# EAGLE design 610_motor (EAGLE 9.6.2)
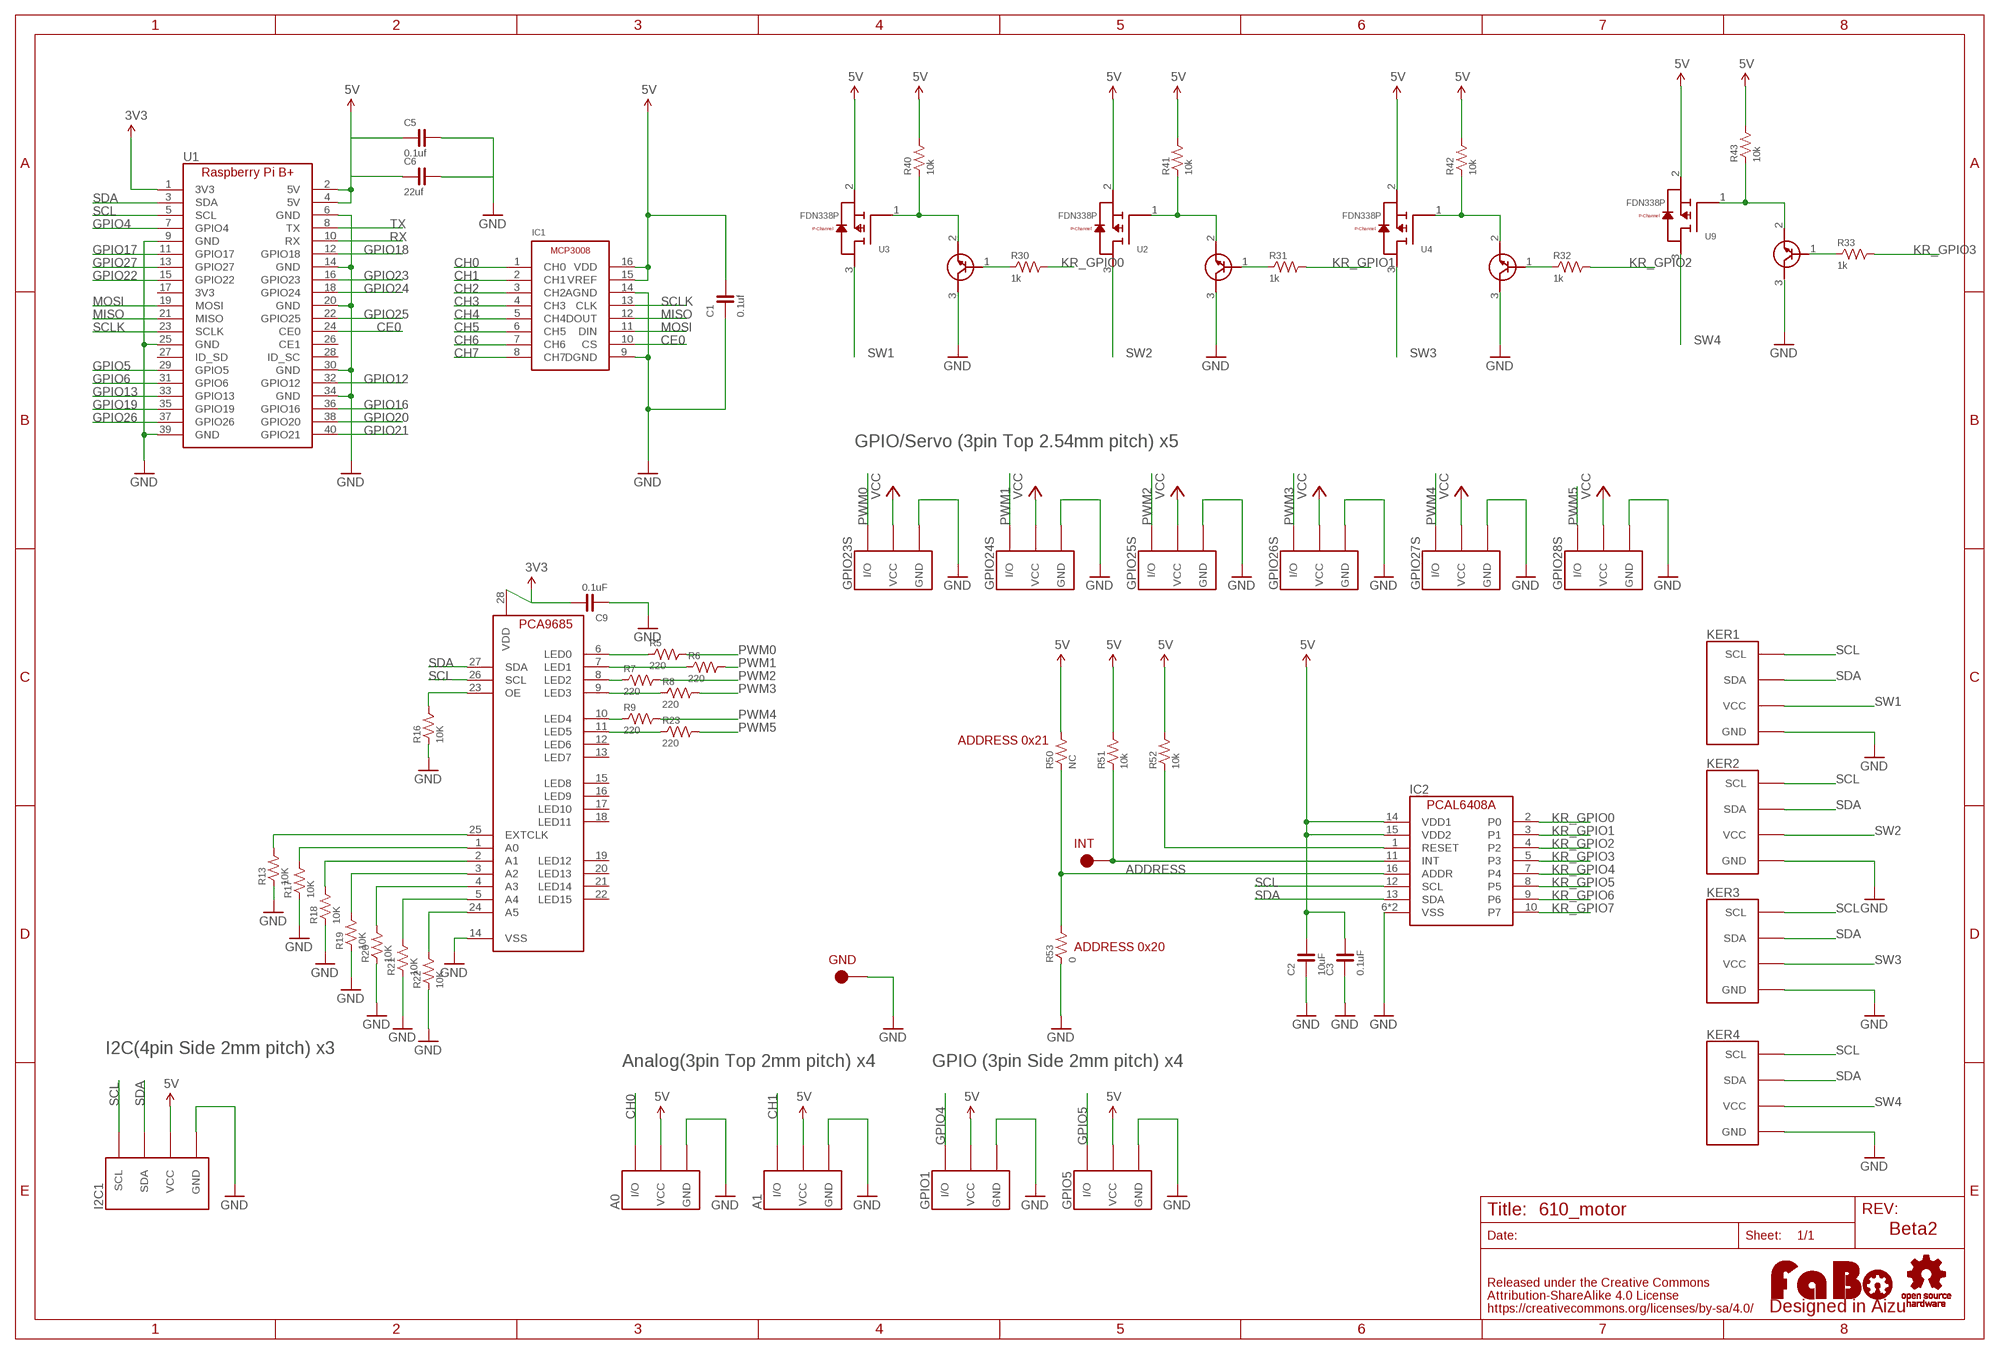
[diagram p0: schematic, sheet 1]

## Parts
A0  FABO_BRICK_3PIN-B03B-PASK-1  [FABO_BRICK_3PIN_B03B-PASK-1]
A1  FABO_BRICK_3PIN-B03B-PASK-1  [FABO_BRICK_3PIN_B03B-PASK-1]
C1  0.1uf  CAPACITOR-0603  [0603]
C2  10uF  CAPACITOR-0603  [0603]
C3  0.1uF  CAPACITOR-0603  [0603]
C5  0.1uf  CAPACITOR-0603  [0603]
C6  22uf  CAPACITOR-0603  [0603]
C9  0.1uF  CAPACITOR-0603  [0603]
GPIO1  FABO_BRICK_3PIN-B03B-PASK-1  [FABO_BRICK_3PIN_B03B-PASK-1]
GPIO5  FABO_BRICK_3PIN-B03B-PASK-1  [FABO_BRICK_3PIN_B03B-PASK-1]
GPIO23S  FABO_BRICK_3PIN-HEADER  [FABO_BRICK_3PIN_HEADER]
GPIO24S  FABO_BRICK_3PIN-HEADER  [FABO_BRICK_3PIN_HEADER]
GPIO25S  FABO_BRICK_3PIN-HEADER  [FABO_BRICK_3PIN_HEADER]
GPIO26S  FABO_BRICK_3PIN-HEADER  [FABO_BRICK_3PIN_HEADER]
GPIO27S  FABO_BRICK_3PIN-HEADER  [FABO_BRICK_3PIN_HEADER]
GPIO28S  FABO_BRICK_3PIN-HEADER  [FABO_BRICK_3PIN_HEADER]
I2C1  FABO_BRICK_I2C-S04B-PASK-2  [FABO_BRICK_I2C_S04B-PASK-2]
IC1  MICROCHIP-MCP3008  [MICROCHIP-MCP3008]
IC2  NX-PCAL6408A  [NXP-PCAL6408A]
KER1  FABO_BRICK_I2C-S04B-PASK-2  [FABO_BRICK_I2C_S04B-PASK-2]
KER2  FABO_BRICK_I2C-S04B-PASK-2  [FABO_BRICK_I2C_S04B-PASK-2]
KER3  FABO_BRICK_I2C-S04B-PASK-2  [FABO_BRICK_I2C_S04B-PASK-2]
KER4  FABO_BRICK_I2C-S04B-PASK-2  [FABO_BRICK_I2C_S04B-PASK-2]
LOGO1  LOGO_FABO-M  [LOGO_FABO_M]
R5  220  RESISTOR-0603  [0603]
R6  220  RESISTOR-0603  [0603]
R7  220  RESISTOR-0603  [0603]
R8  220  RESISTOR-0603  [0603]
R9  220  RESISTOR-0603  [0603]
R13  10K  RESISTOR-0402  [0402]
R16  10K  RESISTOR-0603  [0603]
R17  10K  RESISTOR-0603  [0603]
R18  10K  RESISTOR-0603  [0603]
R19  10K  RESISTOR-0603  [0603]
R20  10K  RESISTOR-0603  [0603]
R21  10K  RESISTOR-0603  [0603]
R22  10K  RESISTOR-0402  [0402]
R23  220  RESISTOR-0603  [0603]
R30  1k  RESISTOR-0603-NARROW  [0603-NARROW]
R31  1k  RESISTOR-0603-NARROW  [0603-NARROW]
R32  1k  RESISTOR-0603-NARROW  [0603-NARROW]
R33  1k  RESISTOR-0603-NARROW  [0603-NARROW]
R40  10k  RESISTOR-0603-NARROW  [0603-NARROW]
R41  10k  RESISTOR-0603-NARROW  [0603-NARROW]
R42  10k  RESISTOR-0603-NARROW  [0603-NARROW]
R43  10k  RESISTOR-0603-NARROW  [0603-NARROW]
R50  NC  RESISTOR-0603-NARROW  [0603-NARROW]
R51  10k  RESISTOR-0603-NARROW  [0603-NARROW]
R52  10k  RESISTOR-0603-NARROW  [0603-NARROW]
R53  0  RESISTOR-0603-NARROW  [0603-NARROW]
T1  TRANSISTORMMBT2222  [SOT-23]
T2  TRANSISTORMMBT2222  [SOT-23]
T3  TRANSISTORMMBT2222  [SOT-23]
T4  TRANSISTORMMBT2222  [SOT-23]
TP1  TP-15  [TP-15]
TP2  TP-15  [TP-15]
U1  RASPBERRY_PI_B+  [RASPBERRY_PI_B+]
U2  FDN338P  [SOT-23]
U3  FDN338P  [SOT-23]
U4  FDN338P  [SOT-23]
U9  FDN338P  [SOT-23]
U$2  LOGO_OSHW-M_BOTTOM  [LOGO_OSHW_M_BOTTOM]
U$9  PCA9685  [PCA9685]

## Nets
3V3: C9.2 U1.1(3V3) U$9.28(VDD)
5V: A0.VCC A1.VCC C1.2 C2.2 C3.2 C5.1 C6.1 GPIO1.VCC GPIO5.VCC I2C1.VCC IC1.15(VREF) IC1.16(VDD) IC2.14(VDD1) IC2.15(VDD2) R40.2 R41.2 R42.2 R43.2 R50.2 R51.2 R52.2 U1.2(5V) U1.4(5V) U2.2(S) U3.2(S) U4.2(S) U9.2(S)
ADDRESS: IC2.16(ADDR) R50.1 R53.2
CE0: IC1.10(CS) U1.24(CE0)
CH0: A0.I/O IC1.1(CH0)
CH1: A1.I/O IC1.2(CH1)
CH2: IC1.3(CH2)
CH3: IC1.4(CH3)
CH4: IC1.5(CH4)
CH5: IC1.6(CH5)
CH6: IC1.7(CH6)
CH7: IC1.8(CH7)
GND: A0.GND A1.GND C1.1 C2.1 C3.1 C5.2 C6.2 C9.1 GPIO1.GND GPIO5.GND GPIO23S.GND GPIO24S.GND GPIO25S.GND GPIO26S.GND GPIO27S.GND GPIO28S.GND I2C1.GND IC1.9(DGND) IC1.14(AGND) IC2.6(VSS) IC2.17(VSS) KER1.GND KER2.GND KER3.GND KER4.GND R13.P$1 R16.1 R17.1 R18.1 R19.1 R20.1 R21.1 R22.P$1 R53.1 T1.3(C) T2.3(C) T3.3(C) T4.3(C) TP2.1 U1.6(GND) U1.9(GND) U1.14(GND) U1.20(GND) U1.25(GND) U1.30(GND) U1.34(GND) U1.39(GND) U$9.14(VSS)
GPIO4: GPIO1.I/O U1.7(GPIO4)
GPIO5: GPIO5.I/O U1.29(GPIO5)
GPIO6: U1.31(GPIO6)
GPIO12: U1.32(GPIO12)
GPIO13: U1.33(GPIO13)
GPIO16: U1.36(GPIO16)
GPIO17: U1.11(GPIO17)
GPIO18: U1.12(GPIO18)
GPIO19: U1.35(GPIO19)
GPIO20: U1.38(GPIO20)
GPIO21: U1.40(GPIO21)
GPIO22: U1.15(GPIO22)
GPIO23: U1.16(GPIO23)
GPIO24: U1.18(GPIO24)
GPIO25: U1.22(GPIO25)
GPIO26: U1.37(GPIO26)
GPIO27: U1.13(GPIO27)
KR_GPIO0: IC2.2(P0) R30.2
KR_GPIO1: IC2.3(P1) R31.2
KR_GPIO2: IC2.4(P2) R32.2
KR_GPIO3: IC2.5(P3) R33.2
KR_GPIO4: IC2.7(P4)
KR_GPIO5: IC2.8(P5)
KR_GPIO6: IC2.9(P6)
KR_GPIO7: IC2.10(P7)
LED0: R5.1 U$9.6(LED0)
LED1: R6.1 U$9.7(LED1)
LED2: R7.1 U$9.8(LED2)
LED3: R8.1 U$9.9(LED3)
LED4: R9.1 U$9.10(LED4)
LED5: R23.1 U$9.11(LED5)
MISO: IC1.12(DOUT) U1.21(MISO)
MOSI: IC1.11(DIN) U1.19(MOSI)
N$2: R31.1 T2.1(B)
N$3: IC2.11(INT) R51.1 TP1.1
N$4: R40.1 T1.2(E) U3.1(G)
N$5: R41.1 T2.2(E) U2.1(G)
N$6: R30.1 T1.1(B)
N$7: R16.2 U$9.23(OE)
N$8: R13.P$2 U$9.25(EXTCLK)
N$9: R17.2 U$9.1(A0)
N$10: R18.2 U$9.2(A1)
N$11: R19.2 U$9.3(A2)
N$12: R20.2 U$9.4(A3)
N$13: R21.2 U$9.5(A4)
N$14: R22.P$2 U$9.24(A5)
N$15: R42.1 T3.2(E) U4.1(G)
N$16: R32.1 T3.1(B)
N$17: IC2.1(RESET) R52.1
N$18: R43.1 T4.2(E) U9.1(G)
N$19: R33.1 T4.1(B)
PWM0: GPIO23S.I/O R5.2
PWM1: GPIO24S.I/O R6.2
PWM2: GPIO25S.I/O R7.2
PWM3: GPIO26S.I/O R8.2
PWM4: GPIO27S.I/O R9.2
PWM5: GPIO28S.I/O R23.2
RX: U1.10(RX)
SCL: I2C1.SCL IC2.12(SCL) KER1.SCL KER2.SCL KER3.SCL KER4.SCL U1.5(SCL) U$9.26(SCL)
SCLK: IC1.13(CLK) U1.23(SCLK)
SDA: I2C1.SDA IC2.13(SDA) KER1.SDA KER2.SDA KER3.SDA KER4.SDA U1.3(SDA) U$9.27(SDA)
SW1: KER1.VCC U3.3(D)
SW2: KER2.VCC U2.3(D)
SW3: KER3.VCC U4.3(D)
SW4: KER4.VCC U9.3(D)
TX: U1.8(TX)
VCC: GPIO23S.VCC GPIO24S.VCC GPIO25S.VCC GPIO26S.VCC GPIO27S.VCC GPIO28S.VCC
Unconnected: U1.17(3V3) U1.26(CE1) U1.27(ID_SD) U1.28(ID_SC) U$9.12(LED6) U$9.13(LED7) U$9.15(LED8) U$9.16(LED9) U$9.17(LED10) U$9.18(LED11) U$9.19(LED12) U$9.20(LED13) U$9.21(LED14) U$9.22(LED15)

## Notes on the sheet
- GPIO/Servo (3pin Top 2.54mm pitch) x5
- ADDRESS 0x21
- INT
- ADDRESS 0x20
- GND
- I2C(4pin Side 2mm pitch) x3
- Analog(3pin Top 2mm pitch) x4 | GPIO (3pin Side 2mm pitch) x4
- Beta2

## Library data of the parts
A0 A1 GPIO1 GPIO5 GPIO23S GPIO24S GPIO25S GPIO26S GPIO27S GPIO28S = FaBo-Template:FABO_BRICK_3PIN: FaBo Brick 3pin
C1-C3 C5 C6 C9 = FaBo-Capacitor:CAPACITOR: CAPACITOR
I2C1 KER1-KER4 = FaBo-Template:FABO_BRICK_I2C: FaBo Brick I2C
IC1 = FaBo-ADC:MICROCHIP-MCP3008
IC2 = FaBo-Mems:NX-PCAL6408A: NXP PCAL6408A
LOGO1 = component:LOGO_FABO
R5-R9 R13 R16-R23 R30-R33 R40-R43 R50-R53 = FaBo-Resistors:RESISTOR: RESISTOR
T1-T4 = FaBo-Transistor:TRANSISTOR
TP1 TP2 = FaBo-Supply:TP
U1 = FaBo-Boards:RASPBERRY_PI_B+
U2-U4 U9 = FaBo-Mosfet2:FDN338P
U$2 = component:LOGO_OSHW
U$9 = FaBo-Motor:PCA9685

## Board
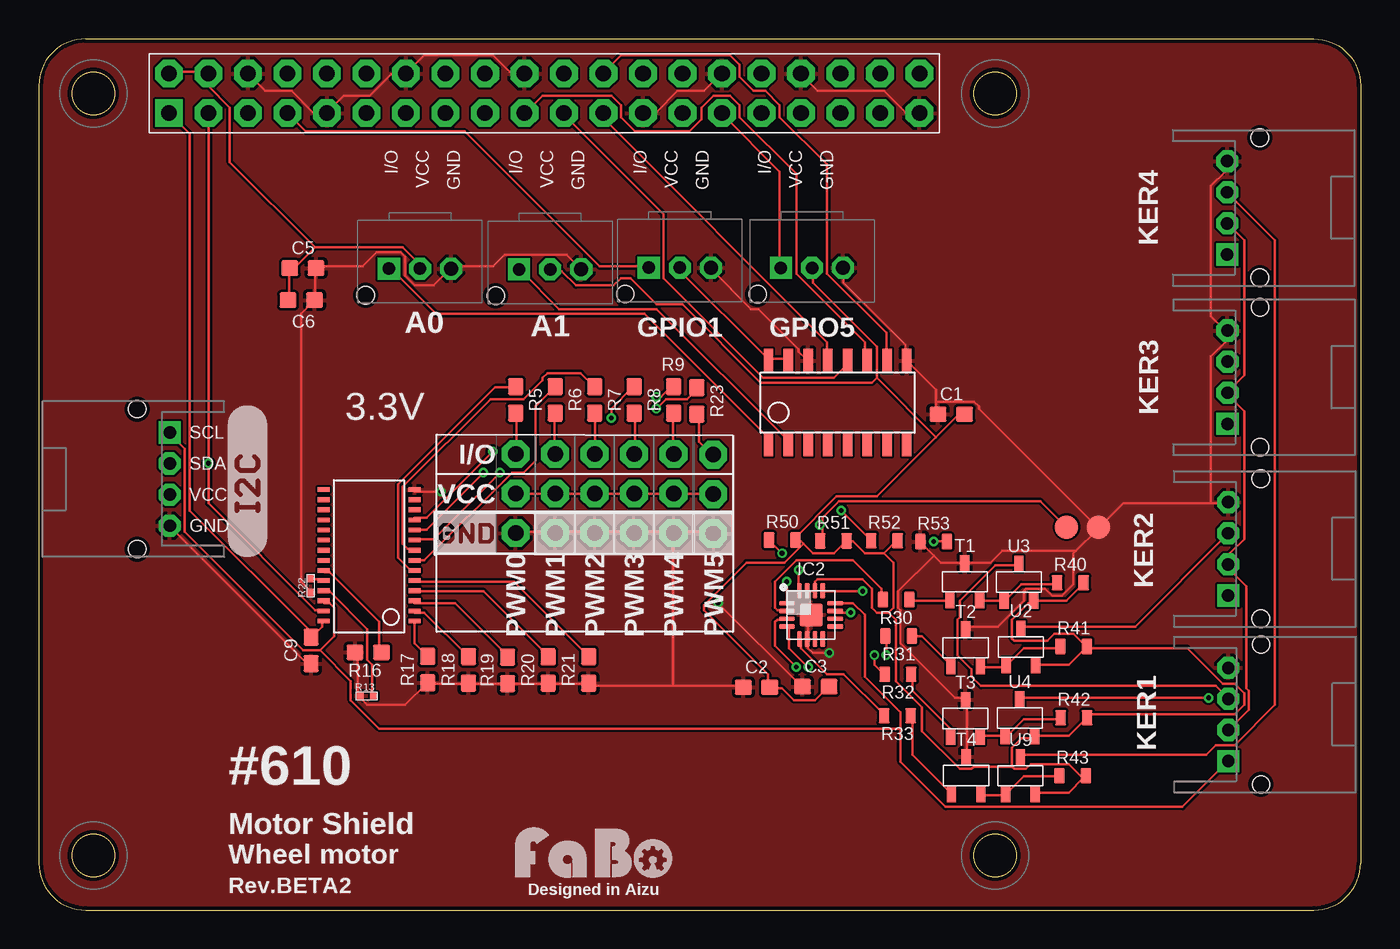
[diagram p1: board, top side]
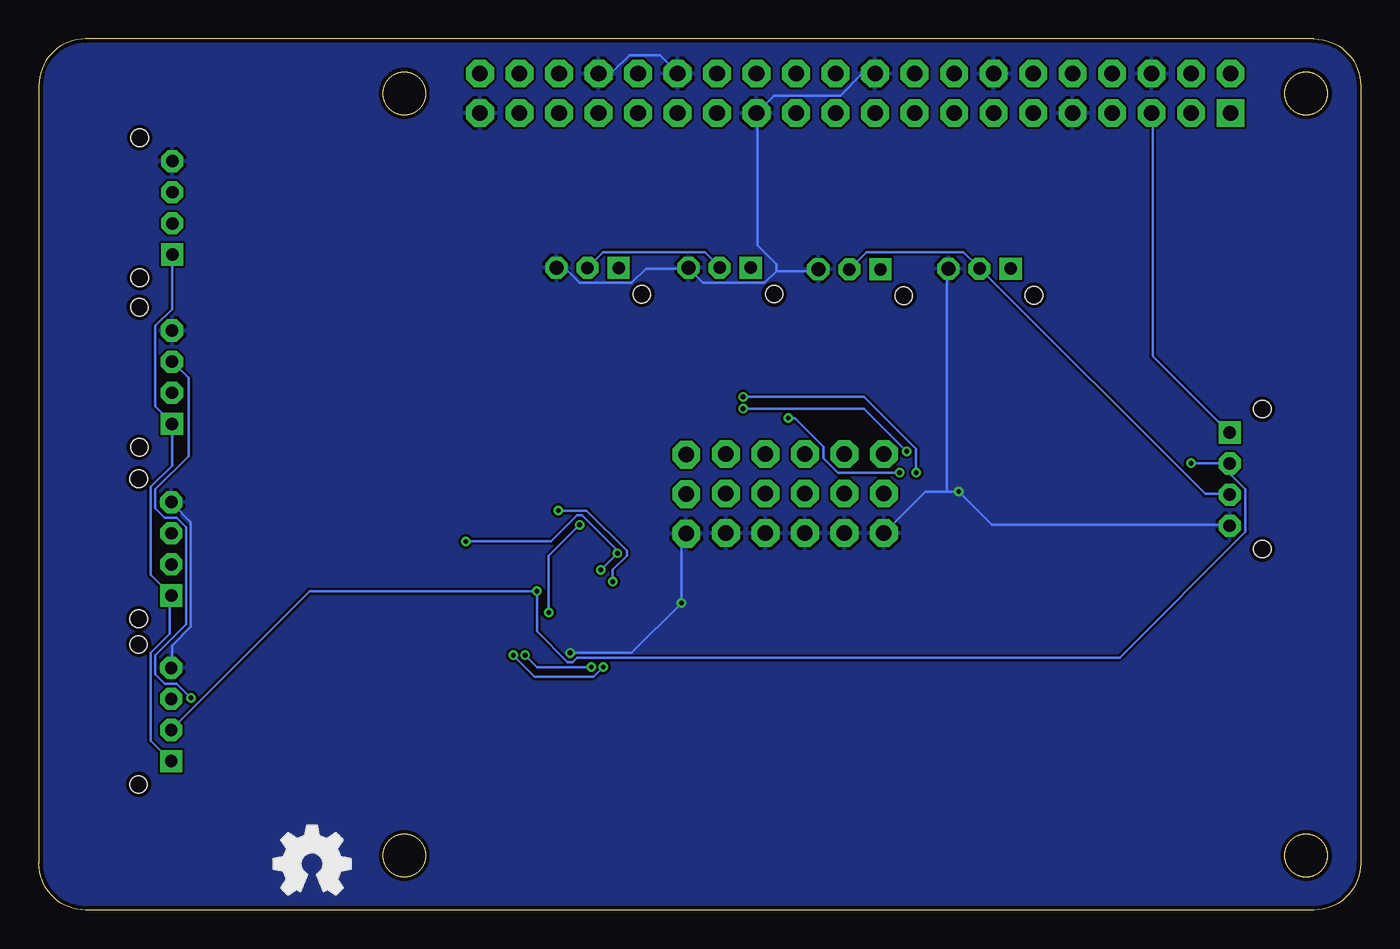
[diagram p2: board, bottom side, seen from below]

Size 85 x 56 mm. Coordinates in mm from the lower left corner, seen from the top.
Copper layers (1*16): Top 0.035mm / dielectric 1.6mm / Bottom 0.035mm
Design rules "PCBway": minimum track width 6mil, minimum drill 12mil, track to track 6mil, track to pad 6mil, pad to pad 6mil, via to via 6mil, smd to smd 6mil, copper to edge 10mil, drill to drill 10mil, minimum pad ring 10mil, minimum via ring 6mil, stop-mask expansion 2mil, vias tented up to drill 100mil, thermal gap 8mil

### Footprints (pad centres in the part's own frame; a part is rotated, then mirrored left to right if it is on the bottom)
FABO_BRICK_3PIN_B03B-PASK-1 = drill 0.9 pad 1.422 octagon: GND -2,0 | drill 0.8 pad 1.422 square: I/O 2,0 | drill 0.8 pad 1.422 octagon: VCC 0,0 | hole 1.1: 3.5,1.7
0603 = smd 1.1 x 1: 1 -0.85,0; 2 0.85,0
FABO_BRICK_3PIN_HEADER = drill 1 pad 1.778 octagon: GND -2.54,0; I/O 2.54,0; VCC 0,0
FABO_BRICK_I2C_S04B-PASK-2 = drill 0.8 pad 1.422 octagon: GND -3,0; SDA 1,0; VCC -1,0 | drill 0.8 pad 1.422 square: SCL 3,0 | hole 1.1: 4.5,2.1; -4.5,2.1
MICROCHIP-MCP3008 = smd 0.6 x 1.5: 1 -4.445,-2.7; 2 -3.175,-2.7; 3 -1.905,-2.7; 4 -0.635,-2.7; 5 0.635,-2.7; 6 1.905,-2.7; 7 3.175,-2.7; 8 4.445,-2.7; 9 4.445,2.7; 10 3.175,2.7; 11 1.905,2.7; 12 0.635,2.7; 13 -0.635,2.7; 14 -1.905,2.7; 15 -3.175,2.7; 16 -4.445,2.7
NXP-PCAL6408A = smd 1 x 0.3: 1 -1.55,0.75; 2 -1.55,0.25; 3 -1.55,-0.25; 4 -1.55,-0.75; 9 1.55,-0.75; 10 1.55,-0.25; 11 1.55,0.25; 12 1.55,0.75 | smd 0.3 x 1: 5 -0.75,-1.55; 6 -0.25,-1.55; 7 0.25,-1.55; 8 0.75,-1.55; 13 0.75,1.55; 14 0.25,1.55; 15 -0.25,1.55; 16 -0.75,1.55 | smd 1.5 x 1.5: 17 0,0
0402 = smd 0.5 x 0.5: P$1 -0.46,0; P$2 0.46,0
0603-NARROW = smd 0.71 x 1: 1 -0.85,0; 2 0.85,0
SOT-23 = smd 0.6 x 1: 1 -0.95,-1.2; 2 0.95,-1.2; 3 0,1.2
TP-15 = smd 1.5 x 1.5: 1 0,0
RASPBERRY_PI_B+ = drill 1 pad 1.778 square: 1 0,-2.54 | drill 1 pad 1.778 octagon: 2 0,0; 3 2.54,-2.54; 4 2.54,0; 5 5.08,-2.54; 6 5.08,0; 7 7.62,-2.54; 8 7.62,0; 9 10.16,-2.54; 10 10.16,0; 11 12.7,-2.54; 12 12.7,0; 13 15.24,-2.54; 14 15.24,0; 15 17.78,-2.54; 16 17.78,0; 17 20.32,-2.54; 18 20.32,0; 19 22.86,-2.54; 20 22.86,0; 21 25.4,-2.54; 22 25.4,0; 23 27.94,-2.54; 24 27.94,0; 25 30.48,-2.54; 26 30.48,0; 27 33.02,-2.54; 28 33.02,0; 29 35.56,-2.54; 30 35.56,0; 31 38.1,-2.54; 32 38.1,0; 33 40.64,-2.54; 34 40.64,0; 35 43.18,-2.54; 36 43.18,0; 37 45.72,-2.54; 38 45.72,0; 39 48.26,-2.54; 40 48.26,0
PCA9685 = smd 0.3 x 0.75: 1 -4.15,-2.93; 2 -3.5,-2.93; 3 -2.85,-2.93; 4 -2.2,-2.93; 5 -1.55,-2.93; 6 -0.9,-2.93; 7 -0.25,-2.93; 8 0.4,-2.93; 9 1.05,-2.93; 10 1.7,-2.93; 11 2.35,-2.93; 12 3,-2.93; 13 3.65,-2.93; 14 4.3,-2.93; 15 4.3,2.92; 16 3.65,2.92; 17 3,2.92; 18 2.35,2.92; 19 1.7,2.92; 20 1.05,2.92; 21 0.4,2.92; 22 -0.25,2.92; 23 -0.9,2.92; 24 -1.55,2.92; 25 -2.2,2.92; 26 -2.85,2.92; 27 -3.5,2.92; 28 -4.15,2.92

### Placement (x,y rotation side)
A0  24.51,41.23 180 top
A1  32.88,41.19 180 top
C1  58.68,31.87 0 top
C2  46.15,14.32 0 top
C3  49.96,14.36 0 top
C5  16.98,41.26 0 top
C6  16.88,39.21 0 top
C9  17.51,16.69 90 top
GPIO1  41.22,41.29 180 top
GPIO5  49.72,41.28 180 top
GPIO23S  30.66,26.77 90 top
GPIO24S  33.2,26.77 90 top
GPIO25S  35.74,26.77 90 top
GPIO26S  38.28,26.77 90 top
GPIO27S  40.82,26.77 90 top
GPIO28S  43.37,26.73 90 top
I2C1  8.42,27.7 90 top
IC1  51.37,32.62 0 top
IC2  49.66,18.97 0 top
KER1  76.49,12.57 270 top
KER2  76.48,23.22 270 top
KER3  76.44,34.25 270 top
KER4  76.42,45.14 270 top
LOGO1  35.67,1.7 0 top
R5  30.66,32.8 270 top
R6  33.2,32.8 270 top
R7  35.74,32.8 270 top
R8  38.28,32.8 270 top
R9  40.82,32.8 270 top
R13  21.08,13.76 0 top
R16  21.18,16.56 0 top
R17  25.01,15.45 90 top
R18  27.63,15.44 90 top
R19  30.14,15.41 90 top
R20  32.75,15.43 90 top
R21  35.35,15.44 90 top
R22  17.48,20.85 90 top
R23  42.32,32.73 270 top
R30  55.13,19.95 180 top
R31  55.29,17.61 180 top
R32  55.25,15.16 180 top
R33  55.21,12.49 180 top
R40  66.33,21.04 0 top
R41  66.54,16.95 0 top
R42  66.56,12.36 0 top
R43  66.48,8.63 0 top
R50  47.81,23.78 0 top
R51  51.1,23.73 0 top
R52  54.37,23.74 0 top
R53  57.54,23.68 0 top
T1  59.54,21.1 0 top
T2  59.6,16.86 0 top
T3  59.59,12.31 0 top
T4  59.63,8.64 0 top
TP1  66.09,24.61 0 top
TP2  68.13,24.61 0 top
U1  8.37,53.77 0 top
U2  63.15,16.91 0 top
U3  63.02,21.08 0 top
U4  63.08,12.35 0 top
U9  63.12,8.63 0 top
U$2  67.42,2.97 0 top
U$6  [LOGO_SILK_I2C]  14.67,22.7 90 top
U$7  [LOGO_SILK_GND]  25.58,22.96 0 top
U$9  21.23,22.73 90 top

### Tracks (layer width: path | path; a pad name or v marks a point on that pad's centre or on a via)
3V3
  Top 0.152: U$9.28 18.23,18.52 18.23,18.21 17.62,17.6 C9.2 17.46,17.6 17.46,17.91 9.69,25.68 9.69,49.91 U1.1
5V
  Top 0.152: U1.2 8.47,53.87 10.91,53.87 U1.4 10.91,52.96 12.28,51.59 12.28,48.08 17.77,42.59 | C6.1 16.09,39.24 16.09,41.22 C5.1 16.24,41.38 16.55,41.38 17.77,42.59 | 17.77,42.59 23.41,42.59 24.63,41.38 A0.VCC | IC1.15 48.1,35.43 47.03,35.43 IC1.16 46.88,35.43 41.08,41.22 GPIO1.VCC | R40.2 67.15,20.95 66.08,19.89 64.1,19.89 U3.2 63.95,19.73 63.64,19.73 62.57,18.67 62.57,17.45 62.73,17.3 64.86,17.3 65.32,17.75 66.54,17.75 67.3,16.99 R41.2 | U2.2 64.25,15.77 66.23,15.77 67.3,16.84 R41.2 | 67.15,8.46 67.3,8.61 R43.2 67.15,8.46 | 67.15,8.46 66.23,7.54 64.1,7.54 U9.2 | 67.15,8.46 66.23,9.37 63.79,9.37 63.49,9.07 62.73,9.07 62.57,9.22 | 62.57,9.22 62.57,10.44 63.18,11.05 63.95,11.05 U4.2 64.1,11.2 66.23,11.2 67.3,12.27 R42.2 67.45,12.42 67.6,12.57 76.9,12.57 77.51,13.18 77.51,13.94 76.9,14.55 76.14,14.55 73.85,16.84 67.45,16.84 R41.2 | C3.2 50.69,14.25 49.92,13.49 48.55,13.49 47.79,14.25 47.03,14.25 C2.2 46.88,14.4 46.88,15.16 42.76,19.28 42.76,19.58 45.5,22.33 47.94,22.33 49.16,23.54 | IC2.15 49.47,20.5 49.77,20.5 IC2.14 49.92,20.65 49.92,21.11 50.08,21.26 52.97,21.26 53.58,20.65 53.58,19.43 53.89,19.12 54.65,19.12 | 54.34,22.93 53.12,22.93 52.36,23.7 52.06,23.7 R51.2 51.91,23.7 51.14,22.93 49.77,22.93 49.16,23.54 | 54.34,22.93 55.11,23.7 R52.2 | 49.16,23.54 49.01,23.7 48.7,23.7 R50.2 48.55,23.85 51.3,26.59 53.89,26.59 57.7,30.4 | 57.7,30.4 59.07,31.77 59.53,31.77 C1.2 | 54.65,19.12 54.95,19.43 54.95,22.33 54.34,22.93 | 62.57,9.22 60.13,9.22 59.98,9.07 59.22,9.07 56.78,11.5 56.78,13.03 55.11,14.71 55.11,18.67 54.65,19.12 | 53.89,34.21 53.89,36.19 49.77,40.31 49.77,41.22 GPIO5.VCC
  Top 0.152: 57.7,30.4 53.89,34.21 | 53.89,34.21 53.58,33.91 46.42,33.91 41.39,38.94 39.71,38.94 38.04,40.61 37.43,40.61 36.97,40.16 34.53,40.16 33.62,41.07 33.01,41.07 A1.VCC
  Bottom 0.152: I2C1.VCC 8.47,26.74 10,26.74 24.47,41.22 A0.VCC 24.63,41.38 25.54,42.29 31.79,42.29 32.86,41.22 A1.VCC | GPIO5.VCC 49.62,41.38 48.7,42.29 42.15,42.29 41.24,41.38 GPIO1.VCC
ADDRESS  (via drill 0.3)
  Top 0.152: v48.86,21.87 48.86,20.65 IC2.16 | v47.79,22.93 47.03,23.7 R50.1 | v57.54,23.7 58.31,23.7 R53.2
  Bottom 0.152: v48.86,21.87 v47.79,22.93 47.79,23.09 50.08,25.37 50.38,25.37 52.06,23.7 v57.54,23.7
CE0
  Top 0.152: IC1.10 54.5,35.43 54.5,37.11 50.69,40.92 50.69,47.93 47.64,50.98 47.64,51.74 46.72,52.65 45.96,52.65 45.05,53.57 45.05,54.33 44.44,54.94 37.43,54.94 36.36,53.87 U1.24
CH0
  Top 0.152: IC1.1 46.88,29.95 46.88,30.4 38.95,38.33 25.54,38.33 22.64,41.22 A0.I/O
CH1
  Top 0.152: IC1.2 48.1,29.95 48.1,30.25 39.71,38.63 33.46,38.63 31.03,41.07 A1.I/O
GND  (via drill 0.3)
  Top 0.152: T4.3 59.68,9.98 59.68,13.49 T3.3 59.53,13.64 58.92,13.64 55.41,17.14 55.41,19.28 55.26,19.43 55.26,20.5 57.54,22.78 | 57.54,22.78 58,22.33 59.53,22.33 T1.3 59.68,22.33 61.2,22.33 61.96,23.09 66.69,23.09 | 57.54,22.78 56.78,23.54 R53.1 | KER4.GND 76.29,48.08 76.29,47.47 75.38,46.56 75.38,38.17 76.29,37.26 KER3.GND 76.29,37.11 76.29,36.5 75.38,35.58 75.38,26.14 | 66.69,23.09 68.06,24.46 TP2.1 | 66.69,23.09 66.54,22.93 66.54,20.95 65.77,20.19 65.16,20.19 64.71,20.65 63.49,20.65 63.34,20.5 63.34,19.89 61.66,18.21 59.68,18.21 T2.3 | 75.38,26.14 69.74,26.14 68.21,24.61 TP2.1 | 75.38,26.14 76.44,26.14 KER2.GND | R16.1 20.36,16.53 20.51,16.38 20.51,13.79 R13.P$1 20.66,13.64 21.12,13.18 23.56,13.18 24.93,14.55 R17.1 25.08,14.55 27.52,14.55 R18.1 27.67,14.55 30.11,14.55 R19.1 30.27,14.55 32.7,14.55 R20.1 32.86,14.55 35.29,14.55 R21.1 35.45,14.55 35.6,14.4 40.78,14.4 | 40.78,14.4 45.2,14.4 C2.1 | C9.1 17.46,15.92 17.16,15.92 8.47,24.61 I2C1.GND | v25.84,26.9 24.17,26.9 U$9.14 | GPIO23S.GND 30.72,24.31 33.16,24.31 GPIO24S.GND 33.31,24.31 35.6,24.31 GPIO25S.GND 35.75,24.31 38.19,24.31 GPIO26S.GND 38.34,24.31 40.78,24.31 GPIO27S.GND | IC2.17 49.62,18.82 49.47,18.67 49.47,17.45 IC2.6 49.47,17.3 49.47,16.84 49.77,16.53 v50.84,16.53 | v43.68,19.73 49.01,14.4 C3.1 | GPIO27S.GND 40.93,24.31 43.22,24.31 GPIO28S.GND | 40.78,14.4 40.78,24.15 GPIO27S.GND | 18.53,51.28 17.62,51.28 16.24,52.65 14.57,52.65 U1.6 | 18.53,51.28 19.6,52.35 21.27,52.35 22.64,53.72 23.56,53.72 U1.14 24.78,54.94 29.2,54.94 30.27,53.87 31.18,53.87 U1.20 | 18.53,51.28 U1.9 | U1.25 38.95,51.28 39.71,51.28 41.08,52.65 42.76,52.65 43.83,53.72 U1.30
  Top 0.152: U1.39 56.63,51.28 55.72,51.28 54.34,52.65 50.08,52.65 49.01,53.72 U1.34 | R22.P$1 17.46,20.5 16.85,21.11 16.85,38.33 17.62,39.09 C6.2 17.77,39.24 17.77,41.22 C5.2 17.92,41.38 20.82,41.38 21.73,42.29 23.25,42.29 23.56,41.98 23.56,40.77 24.17,40.16 25.39,40.16 26.45,41.22 A0.GND 26.61,41.38 29.2,41.38 29.96,42.14 33.92,42.14 34.84,41.22 A1.GND | 57.7,32.69 57.7,33.45 55.87,35.28 IC1.9 55.72,35.43 55.72,36.35 51.75,40.31 51.75,41.22 GPIO5.GND | 57.7,32.69 57.7,31.93 C1.1 | IC1.14 49.31,35.43 48.86,35.89 48.86,36.04 46.27,38.63 45.81,38.63 43.22,41.22 GPIO1.GND | 57.7,32.69 60.13,32.69 60.44,32.38 60.44,32.23 68.06,24.61 TP2.1
  Bottom 0.152: KER1.GND 76.44,15.62 76.44,16.99 75.22,18.21 75.22,24.92 76.44,26.14 KER2.GND | 26.61,26.9 27.98,26.9 30.57,24.31 GPIO23S.GND | 26.61,26.9 v25.84,26.9 23.71,24.76 8.47,24.76 I2C1.GND | GPIO28S.GND 43.37,24.15 43.68,23.85 v43.68,19.73 46.88,16.53 v50.84,16.53 | U1.34 49.01,53.87 48.1,53.87 47.03,54.94 45.05,54.94 43.98,53.87 U1.30 | U1.20 31.33,53.72 32.09,53.72 33.46,52.35 37.73,52.35 U1.25 38.8,51.13 38.8,42.75 37.58,41.53 37.58,41.07 | 37.58,41.07 34.99,41.07 A1.GND | 37.58,41.07 38.34,40.31 42.3,40.31 43.22,41.22 GPIO1.GND 43.37,41.22 45.96,41.22 46.88,40.31 50.23,40.31 51.14,41.22 51.6,41.22 GPIO5.GND | 26.61,26.9 26.61,41.22 A0.GND
  pour Top: -0.52,-0.84 85.84,-0.84 85.84,56.31 -0.52,56.31
  pour Bottom: -0.52,-0.84 85.84,-0.84 85.84,56.31 -0.52,56.31
GPIO4
  Top 0.152: U1.7 17.16,50.06 27.37,50.06 36.06,41.38 39.1,41.38 GPIO1.I/O
GPIO5
  Top 0.152: GPIO5.I/O 47.64,41.38 47.64,47.47 43.98,51.13 U1.29
KR_GPIO0
  Top 0.152: IC2.2 48.1,19.28 47.49,19.28 47.33,19.43 47.33,21.11 48.7,22.48 52.36,22.48 54.19,20.65 54.19,20.04 R30.2
KR_GPIO1  (via drill 0.3)
  Top 0.152: v48.7,15.62 47.33,16.99 47.33,18.52 47.49,18.67 48.1,18.67 IC2.3 | v54.5,16.38 54.5,17.6 R31.2
  Bottom 0.152: v48.7,15.62 49.31,15.01 53.12,15.01 v54.5,16.38
KR_GPIO2  (via drill 0.3)
  Top 0.152: v49.47,15.62 48.25,16.84 48.25,18.21 IC2.4 | v53.73,16.38 53.73,15.77 54.34,15.16 R32.2
  Bottom 0.152: v49.47,15.62 52.97,15.62 v53.73,16.38
KR_GPIO3
  Top 0.152: IC2.5 49.01,17.3 49.01,16.84 50.69,15.16 51.75,15.16 54.34,12.57 R33.2
LED0
  Top 0.152: U$9.6 24.02,21.87 23.86,21.87 23.1,22.63 23.1,27.35 29.35,33.6 30.57,33.6 R5.1
LED1
  Top 0.152: U$9.7 24.78,22.48 30.42,28.12 31.18,28.12 31.94,28.88 31.94,32.38 33.16,33.6 R6.1
LED2
  Top 0.152: U$9.8 24.02,23.24 23.71,23.24 23.41,23.54 23.41,27.2 29.05,32.84 31.18,32.84 32.4,34.06 32.4,34.21 32.7,34.52 34.84,34.52 35.6,33.76 R7.1
LED3  (via drill 0.3)
  Top 0.152: v29.66,28.12 25.39,23.85 24.17,23.85 U$9.9 | v36.82,31.62 36.82,32.23 38.19,33.6 R8.1
  Bottom 0.152: v29.66,28.12 33.62,28.12 34.53,29.03 34.53,29.79 36.36,31.62 v36.82,31.62
LED4  (via drill 0.3)
  Top 0.152: v28.59,28.12 24.93,24.46 24.17,24.46 U$9.10 | v39.71,32.99 40.02,32.99 40.78,33.76 R9.1
  Bottom 0.152: v28.59,28.12 28.59,29.64 31.94,32.99 v39.71,32.99
LED5  (via drill 0.3)
  Top 0.152: v29.2,29.49 24.93,25.22 24.17,25.22 U$9.11 | v39.71,32.23 40.32,32.84 41.7,32.84 42.3,33.45 R23.1
  Bottom 0.152: v29.2,29.49 31.94,32.23 v39.71,32.23
MISO
  Top 0.152: IC1.12 51.91,35.28 51.91,34.97 51.14,34.21 46.57,34.21 40.17,40.61 40.17,44.73 33.77,51.13 U1.21
MOSI
  Top 0.152: IC1.11 53.12,35.43 53.12,36.5 48.7,40.92 48.7,47.32 45.05,50.98 45.05,51.74 44.44,52.35 43.37,52.35 42.61,51.59 42.61,50.82 41.85,50.06 38.34,50.06 37.43,50.98 37.43,51.74 36.82,52.35 32.4,52.35 31.33,51.28 U1.19
N$2
  Top 0.152: R31.1 56.17,17.6 56.78,17.6 58.61,15.77 T2.1
N$3  (via drill 0.3)
  Top 0.152: 50.38,24.76 50.38,25.22 51.45,26.29 64.4,26.29 TP1.1 | 50.38,24.76 50.38,23.85 R51.1 | v52.21,19.12 51.3,19.12 IC2.11 | 50.38,24.76 v50.23,24.76
  Bottom 0.152: v52.21,19.12 52.21,22.78 v50.23,24.76
N$4
  Top 0.152: T1.2 60.59,19.89 61.96,19.89 U3.1 62.12,19.89 63.18,20.95 65.47,20.95 R40.1
N$5
  Top 0.152: T2.2 60.59,15.62 62.12,15.62 U2.1 62.27,15.77 63.34,16.84 65.62,16.84 R41.1
N$6
  Top 0.152: T1.1 58.46,19.89 56.02,19.89 R30.1
N$7
  Top 0.152: U$9.23 18.38,21.72 18.68,21.72 21.88,18.52 21.88,16.69 R16.2
N$8
  Top 0.152: R13.P$2 21.43,13.79 21.43,15.77 21.12,16.08 21.12,18.06 18.68,20.5 18.38,20.5 U$9.25
N$9
  Top 0.152: U$9.1 24.17,18.52 24.17,17.14 24.93,16.38 R17.2
N$10
  Top 0.152: U$9.2 24.17,19.12 24.78,19.12 27.52,16.38 R18.2
N$11
  Top 0.152: U$9.3 24.17,19.73 26.76,19.73 30.11,16.38 R19.2
N$12
  Top 0.152: U$9.4 24.17,20.5 28.59,20.5 32.7,16.38 R20.2
N$13
  Top 0.152: U$9.5 24.17,21.11 30.57,21.11 35.29,16.38 R21.2
N$14
  Top 0.152: R22.P$2 17.62,21.26 18.23,21.26 U$9.24
N$15
  Top 0.152: T3.2 60.59,11.2 62.12,11.2 U4.1 62.27,11.2 63.34,12.27 65.62,12.27 R42.1
N$16
  Top 0.152: R32.1 56.17,15.01 56.17,14.1 58.61,11.66 58.61,11.2 T3.1
N$17  (via drill 0.3)
  Top 0.152: v48.1,21.11 48.1,19.73 IC2.1 | v51.6,25.68 53.43,23.85 R52.1
  Bottom 0.152: v48.1,21.11 48.1,21.87 47.18,22.78 47.18,23.09 49.77,25.68 v51.6,25.68
N$18
  Top 0.152: T4.2 60.59,7.39 62.12,7.39 U9.1 62.27,7.54 63.34,8.61 65.62,8.61 R43.1
N$19
  Top 0.152: R33.1 56.17,12.42 56.17,9.98 58.61,7.54 T4.1
PWM0
  Top 0.152: R5.2 30.72,31.93 30.72,29.34 GPIO23S.I/O
PWM1
  Top 0.152: R6.2 33.16,31.93 33.16,29.34 GPIO24S.I/O
PWM2
  Top 0.152: R7.2 35.75,31.93 35.75,29.34 GPIO25S.I/O
PWM3
  Top 0.152: R8.2 38.34,31.93 38.34,29.34 GPIO26S.I/O
PWM4
  Top 0.152: R9.2 40.78,31.93 40.78,29.34 GPIO27S.I/O
PWM5
  Top 0.152: R23.2 42.46,31.77 42.46,30.1 43.22,29.34 GPIO28S.I/O
SCL
  Top 0.152: 18.07,16.69 18.99,17.6 18.99,19.43 18.68,19.73 18.38,19.73 U$9.26 | 18.07,16.69 17.01,16.69 9.39,24.31 9.39,29.64 8.47,30.55 I2C1.SCL | 55.41,11.66 55.41,9.52 58.31,6.63 73.55,6.63 76.44,9.52 KER1.SCL | 55.41,11.66 55.41,12.72 53.12,15.01 53.12,18.97 52.36,19.73 51.3,19.73 IC2.12 | 18.07,16.69 20.05,14.71 20.05,13.49 21.88,11.66 55.41,11.66
  Bottom 0.152: U1.5 13.35,51.13 13.35,35.58 8.47,30.71 I2C1.SCL | KER4.SCL 76.44,42.14 76.44,38.63 77.51,37.57 77.51,32.38 76.44,31.32 KER3.SCL 76.44,31.16 76.44,28.57 77.81,27.2 77.81,21.56 76.59,20.34 KER2.SCL 76.59,20.19 76.59,17.75 77.81,16.53 77.81,10.9 76.59,9.68 KER1.SCL
SCLK
  Top 0.152: IC1.13 50.69,35.43 50.69,36.5 36.36,50.82 36.36,51.13 U1.23
SDA  (via drill 0.3)
  Top 0.152: U1.3 v10.91,28.73 10.91,26.14 17.77,19.28 18.23,19.28 U$9.27 | KER4.SDA 77.51,43.05 77.51,34.36 76.44,33.3 KER3.SDA 76.44,33.15 77.51,32.08 77.51,23.85 76.59,22.93 76.59,22.33 KER2.SDA 76.59,22.17 76.59,21.87 77.66,20.8 77.66,14.25 77.81,14.1 77.81,12.88 76.59,11.66 KER1.SDA | v52.97,20.5 50.53,20.5 IC2.13
  Bottom 0.152: v10.91,28.73 8.47,28.73 I2C1.SDA 8.32,28.57 8.32,27.96 7.4,27.05 7.4,24.31 15.48,16.23 50.38,16.23 50.69,15.92 50.99,15.92 52.97,17.91 v52.97,20.5 67.6,20.5 76.44,11.66 KER1.SDA
SW1
  Top 0.152: U3.3 62.88,22.17 61.51,22.17 59.22,19.89 59.22,18.82 59.07,18.67 59.07,16.38 59.98,15.47 59.98,15.01 60.59,14.4 75.68,14.4 76.44,13.64 KER1.VCC
SW2
  Top 0.152: U2.3 63.18,18.21 70.5,18.21 76.44,24.15 KER2.VCC
SW3  (via drill 0.3)
  Top 0.152: v75.22,13.64 63.18,13.64 U4.3
  Bottom 0.152: v75.22,13.64 76.14,14.55 76.9,14.55 77.51,15.16 77.51,16.38 75.53,18.36 75.53,24.61 76.14,25.22 76.9,25.22 77.51,25.83 77.51,27.05 75.38,29.18 75.38,34.21 76.29,35.13 KER3.VCC
SW4
  Top 0.152: U9.3 63.18,9.98 75.07,9.98 75.68,10.59 76.9,10.59 79.49,13.18 79.49,43.05 76.44,46.1 KER4.VCC
VCC
  Top 0.152: GPIO23S.VCC 30.72,26.74 33.16,26.74 GPIO24S.VCC 33.31,26.74 35.6,26.74 GPIO25S.VCC 35.75,26.74 38.19,26.74 GPIO26S.VCC 38.34,26.74 40.78,26.74 GPIO27S.VCC 40.93,26.74 43.22,26.74 GPIO28S.VCC

### Text on the board
tPlace: I/O | VCC | GND | I/O | VCC | GND | I/O | VCC | GND | I/O | VCC | GND | SCL | 3.3V | SDA | I/O | VCC | VCC | GND | PWM0 | PWM1 | PWM2 | PWM3 | PWM4 | PWM5 | #610 | Motor Shield | Wheel motor | Designed in Aizu | Rev.BETA2